# EAGLE schematic ShadowDuck_USB_A (EAGLE 9.6.2)
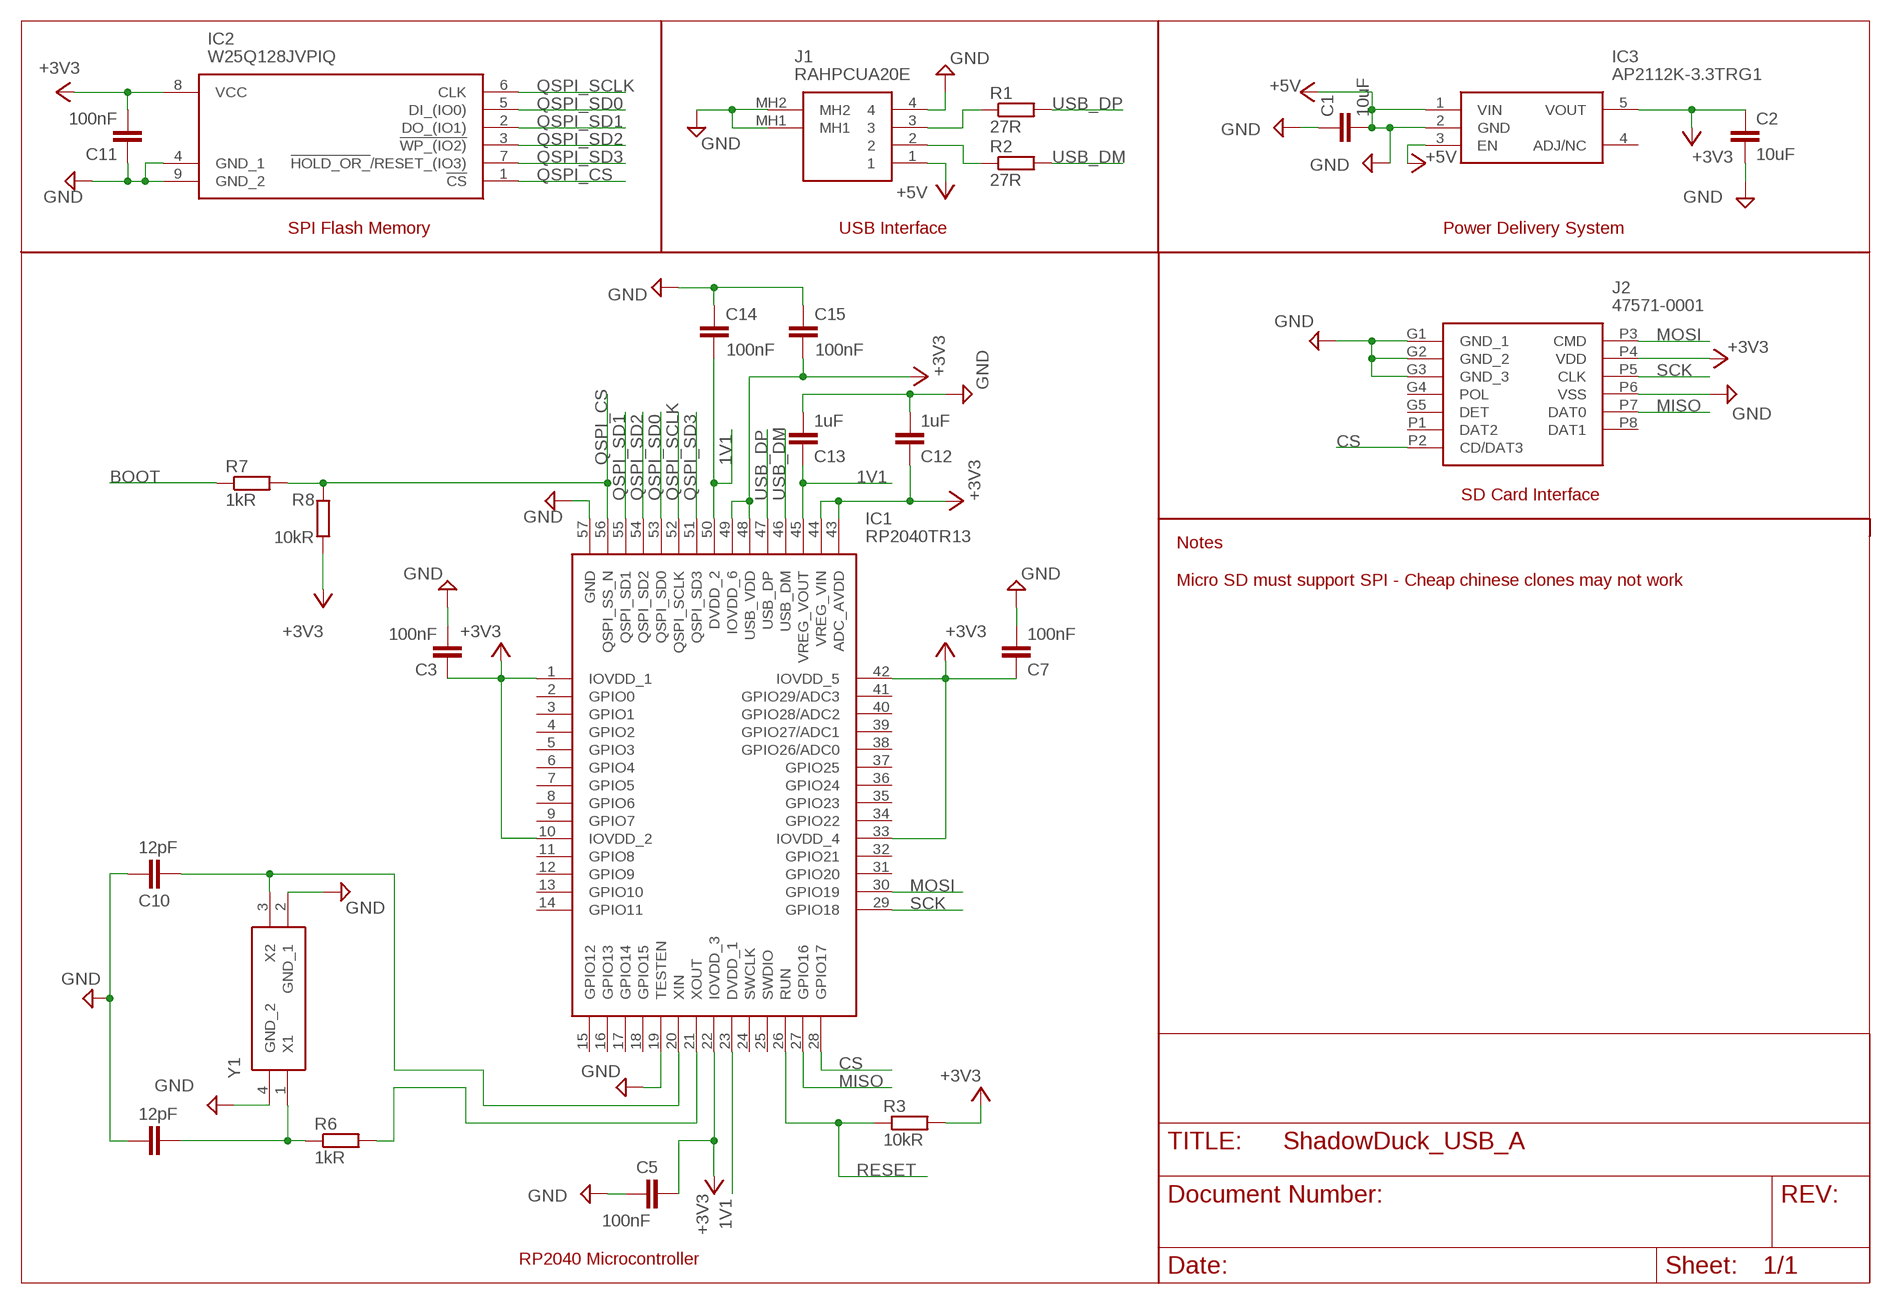
[diagram p0: schematic, sheet 1]

## Parts
C1  10uF  C-EUC0805K  [C0805K]
C2  10uF  C-EUC0805K  [C0805K]
C3  100nF  C-EUC0402K  [C0402K]
C5  100nF  C-EUC0402K  [C0402K]
C7  100nF  C-EUC0402K  [C0402K]
C9  12pF  C-EUC0402K  [C0402K]
C10  12pF  C-EUC0402K  [C0402K]
C11  100nF  C-EUC0402K  [C0402K]
C12  1uF  C-EUC0402K  [C0402K]
C13  1uF  C-EUC0402K  [C0402K]
C14  100nF  C-EUC0402K  [C0402K]
C15  100nF  C-EUC0402K  [C0402K]
IC1  RP2040TR13  [RP2040TR13]
IC2  W25Q128JVPIQ  [SON127P600X500X80-9N]
IC3  AP2112K-3.3TRG1  [SOT95P282X130-5N]
J1  RAHPCUA20E  [RAHPCUA20E]
J2  47571-0001  [475710001]
R1  27R  R-EU_R0402  [R0402]
R2  27R  R-EU_R0402  [R0402]
R3  10kR  R-EU_R0402  [R0402]
R6  1kR  R-EU_R0402  [R0402]
R7  1kR  R-EU_R0402  [R0402]
R8  10kR  R-EU_R0402  [R0402]
Y1  ABM3BAIG-12.000MHZ-12-4-T  [ABM3BAIG]

## Nets
1V1: C13.1 C14.2 IC1.23(DVDD_1) IC1.45(VREG_VOUT) IC1.50(DVDD_2)
+3V3: C2.1 C3.1 C5.1 C7.1 C11.2 C12.1 C15.2 IC1.1(IOVDD_1) IC1.10(IOVDD_2) IC1.22(IOVDD_3) IC1.33(IOVDD_4) IC1.42(IOVDD_5) IC1.43(ADC_AVDD) IC1.44(VREG_VIN) IC1.48(USB_VDD) IC1.49(IOVDD_6) IC2.8(VCC) IC3.5(VOUT) J2.P4(VDD) R3.2 R8.1
+5V: C1.2 IC3.1(VIN) IC3.2(GND) IC3.3(EN) J1.1 ; supply symbol labelled GND
BOOT: R7.1
CS: IC1.28(GPIO17) J2.P2(CD/DAT3)
GND: C1.1 C2.2 C3.2 C5.2 C7.2 C9.1 C10.1 C11.1 C12.2 C13.2 C14.1 C15.1 IC1.19(TESTEN) IC1.57(GND) IC2.4(GND_1) IC2.9(GND_2) J1.4 J1.MH1 J1.MH2 J2.G1(GND_1) J2.G2(GND_2) J2.G3(GND_3) J2.P6(VSS) Y1.2(GND_1) Y1.4(GND_2)
MISO: IC1.27(GPIO16) J2.P7(DAT0)
MOSI: IC1.30(GPIO19) J2.P3(CMD)
N$1: C10.2 IC1.20(XIN) Y1.3(X2)
N$2: IC1.21(XOUT) R6.2
N$3: J1.3 R1.1
N$4: C9.2 R6.1 Y1.1(X1)
N$5: J1.2 R2.1
QSPI_CS: IC1.56(QSPI_SS_N) IC2.1(!CS) R7.2 R8.2
QSPI_SCLK: IC1.52(QSPI_SCLK) IC2.6(CLK)
QSPI_SD0: IC1.53(QSPI_SD0) IC2.5(DI_(IO0))
QSPI_SD1: IC1.55(QSPI_SD1) IC2.2(DO_(IO1))
QSPI_SD2: IC1.54(QSPI_SD2) IC2.3(!WP_(IO2))
QSPI_SD3: IC1.51(QSPI_SD3) IC2.7(!HOLD_OR_!/RESET_(IO3))
RESET: IC1.26(RUN) R3.1
SCK: IC1.29(GPIO18) J2.P5(CLK)
USB_DM: IC1.46(USB_DM) R2.2
USB_DP: IC1.47(USB_DP) R1.2
Unconnected: IC1.2(GPIO0) IC1.3(GPIO1) IC1.4(GPIO2) IC1.5(GPIO3) IC1.6(GPIO4) IC1.7(GPIO5) IC1.8(GPIO6) IC1.9(GPIO7) IC1.11(GPIO8) IC1.12(GPIO9) IC1.13(GPIO10) IC1.14(GPIO11) IC1.15(GPIO12) IC1.16(GPIO13) IC1.17(GPIO14) IC1.18(GPIO15) IC1.24(SWCLK) IC1.25(SWDIO) IC1.31(GPIO20) IC1.32(GPIO21) IC1.34(GPIO22) IC1.35(GPIO23) IC1.36(GPIO24) IC1.37(GPIO25) IC1.38(GPIO26/ADC0) IC1.39(GPIO27/ADC1) IC1.40(GPIO28/ADC2) IC1.41(GPIO29/ADC3) IC3.4(ADJ/NC) J2.G4(POL) J2.G5(DET) J2.P1(DAT2) J2.P8(DAT1)

## Notes on the sheet
- SPI Flash Memory | USB Interface | Power Delivery System
- SD Card Interface
- Notes
  
  Micro SD must support SPI - Cheap chinese clones may not work
- RP2040 Microcontroller

## Library data of the parts
C1-C3 C5 C7 C9-C15 = rcl:C-EU: CAPACITOR, European symbol; SPICEPREFIX: C
IC1 = RP2040TR13:RP2040TR13: RASPBERRY-PI - RP2040TR13 - ARM MCU, RP2040 Series Microcontrollers, ARM Cortex-M0+, 32 bit, 133 MHz, 16 MB, 56 Pins Source: Datasheet <https://www.farnell.com/datasheets/3213406.pdf>; DESCRIPTION: RASPBERRY-PI - RP2040TR13 - ARM MCU, RP2040 Series Microcontrollers, ARM Cortex-M0+, 32 bit, 133 MHz, 16 MB, 56 Pins; HEIGHT: 0.9mm; MANUFACTURER_NAME: RASPBERRY-PI; MANUFACTURER_PART_NUMBER: RP2040TR13
IC2 = W25Q128JVPIQ:W25Q128JVPIQ: 128M-bit Serial Flash Memory with uniform 4KB sectors and Dual/Quad SPI Source: Datasheet <https://www.winbond.com/hq/search-resource-file.jsp?partNo=W25Q128JVPIQ&type=datasheet>; ARROW_PART_NUMBER: W25Q128JVPIQ; ARROW_PRICE-STOCK: https://www.arrow.com/en/products/w25q128jvpiq/winbond-electronics?region=nac; DESCRIPTION: 128M-bit Serial Flash Memory with uniform 4KB sectors and Dual/Quad SPI; HEIGHT: 0.8mm; MANUFACTURER_NAME: Winbond; MANUFACTURER_PART_NUMBER: W25Q128JVPIQ; MOUSER_PART_NUMBER: 454-W25Q128JVPIQ; MOUSER_PRICE-STOCK: https://www.mouser.co.uk/ProductDetail/Winbond/W25Q128JVPIQ?qs=qSfuJ%252Bfl%2Fd676hAD%252B1JSfw%3D%3D
IC3 = AP2112K-3.3TRG1:AP2112K-3.3TRG1: 600mA 3.3V LDO Regulator Enable SOT23-5 DiodesZetex AP2112K-3.3TRG1, LDO Voltage Regulator, 3.3 V +/-1.5%, 2.5 6 Vin, 5-Pin SOT-23 Source: Datasheet <http://uk.rs-online.com/web/p/products/8283509>; ARROW_PART_NUMBER: AP2112K-3.3TRG1; ARROW_PRICE-STOCK: https://www.arrow.com/en/products/ap2112k-3.3trg1/diodes-incorporated?region=nac; DESCRIPTION: 600mA 3.3V LDO Regulator Enable SOT23-5 DiodesZetex AP2112K-3.3TRG1, LDO Voltage Regulator, 3.3 V +/-1.5%, 2.5 6 Vin, 5-Pin SOT-23; HEIGHT: 1.3mm; MANUFACTURER_NAME: Diodes Incorporated; MANUFACTURER_PART_NUMBER: AP2112K-3.3TRG1; MOUSER_PART_NUMBER: 621-AP2112K-3.3TRG1; MOUSER_PRICE-STOCK: https://www.mouser.co.uk/ProductDetail/Diodes-Incorporated/AP2112K-3.3TRG1?qs=x6A8l6qLYDDPYHosCdzh%2FA%3D%3D
J1 = RAHPCUA20E:RAHPCUA20E: USB Type-A 2.0 Connector, Right Angle Horizontal Thru-Hole, Steel Shell Source: Datasheet <https://www.switchcraft.com/assets/1/6/RAHPCUA20E_CD.pdf?9060>; ARROW_PART_NUMBER: RAHPCUA20E; ARROW_PRICE-STOCK: https://www.arrow.com/en/products/rahpcua20e/switchcraft?region=nac; DESCRIPTION: USB Type-A 2.0 Connector, Right Angle Horizontal Thru-Hole, Steel Shell; HEIGHT: 5mm; MANUFACTURER_NAME: Switchcraft; MANUFACTURER_PART_NUMBER: RAHPCUA20E; MOUSER_PART_NUMBER: 502-RAHPCUA20E; MOUSER_PRICE-STOCK: https://www.mouser.co.uk/ProductDetail/Switchcraft/RAHPCUA20E?qs=rQFj71Wb1eXCXM2gH2lXow%3D%3D
J2 = 47571-0001:47571-0001: Memory Card Connectors ASSY FOR TFR HEADER HEADER W/DETECT PIN Source: Datasheet <https://componentsearchengine.com/Datasheets/2/47571-0001.pdf>; DESCRIPTION: Memory Card Connectors ASSY FOR TFR HEADER HEADER W/DETECT PIN; HEIGHT: 2.3mm; MANUFACTURER_NAME: Molex; MANUFACTURER_PART_NUMBER: 47571-0001; MOUSER_PART_NUMBER: 538-47571-0001; MOUSER_PRICE-STOCK: https://www.mouser.co.uk/ProductDetail/Molex/47571-0001?qs=qM7ngqbhX5UTJOg9nqKLJQ%3D%3D
R1-R3 R6-R8 = rcl:R-EU_: RESISTOR, European symbol; SPICEPREFIX: R
Y1 = ABM3BAIG-12.000MHZ-12-4-T:ABM3BAIG-12.000MHZ-12-4-T: 12 MHz +/-30ppm Crystal 12pF 70 Ohms 4-SMD, No Lead Source: Datasheet <https://abracon.com/AIGcrystals/ABM3BAIG.pdf>; ARROW_PART_NUMBER: ABM3BAIG-12.000MHZ-12-4-T; ARROW_PRICE-STOCK: https://www.arrow.com/en/products/abm3baig-12.000mhz-12-4-t/abracon?region=nac; DESCRIPTION: 12 MHz +/-30ppm Crystal 12pF 70 Ohms 4-SMD, No Lead; HEIGHT: 0.9mm; MANUFACTURER_NAME: ABRACON; MANUFACTURER_PART_NUMBER: ABM3BAIG-12.000MHZ-12-4-T; MOUSER_PART_NUMBER: 815-ABM3BAIG1212-4T; MOUSER_PRICE-STOCK: https://www.mouser.co.uk/ProductDetail/ABRACON/ABM3BAIG-12.000MHz-12-4-T?qs=0lSvoLzn4L9fUl2r3xsu2A%3D%3D